# EAGLE design 00A-85 (EAGLE 6.3)
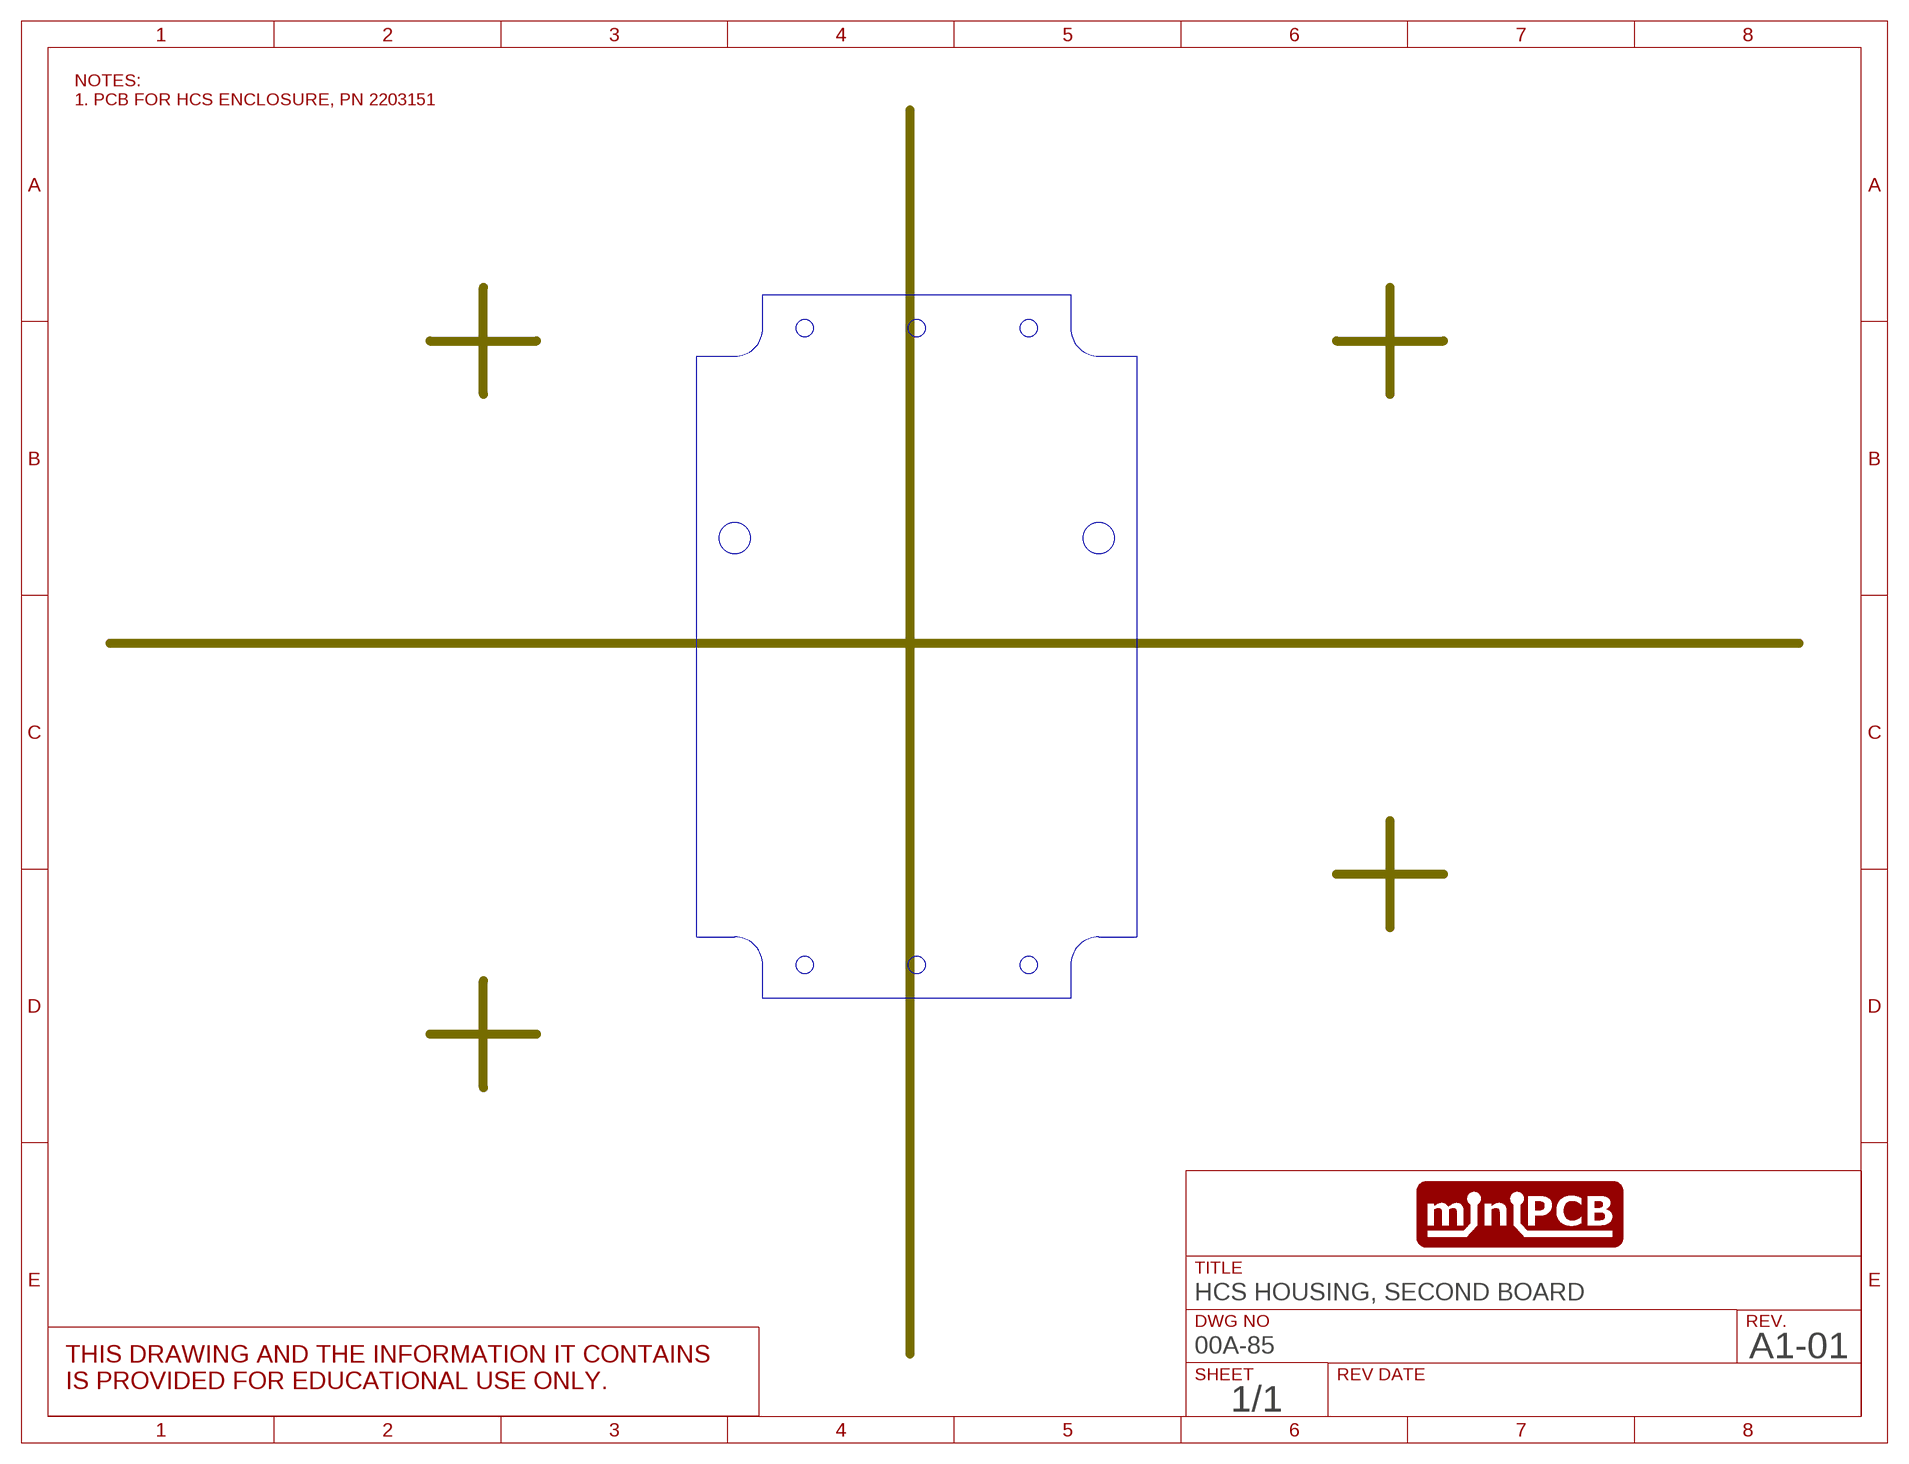
[diagram p0: schematic, sheet 1]
SHEET1 (SCHEMATIC): DWG_NO: 00A-85; REV: A1-01; TITLE: HCS HOUSING, SECOND BOARD

## Parts
U$1  HCS_HOUSING  [HCS_HOUSING_SECOND]

## Notes on the sheet
- NOTES:
  1. PCB FOR HCS ENCLOSURE, PN 2203151

## Library data of the parts
U$1 = miniPCB_BOARDS:HCS_HOUSING

## Board
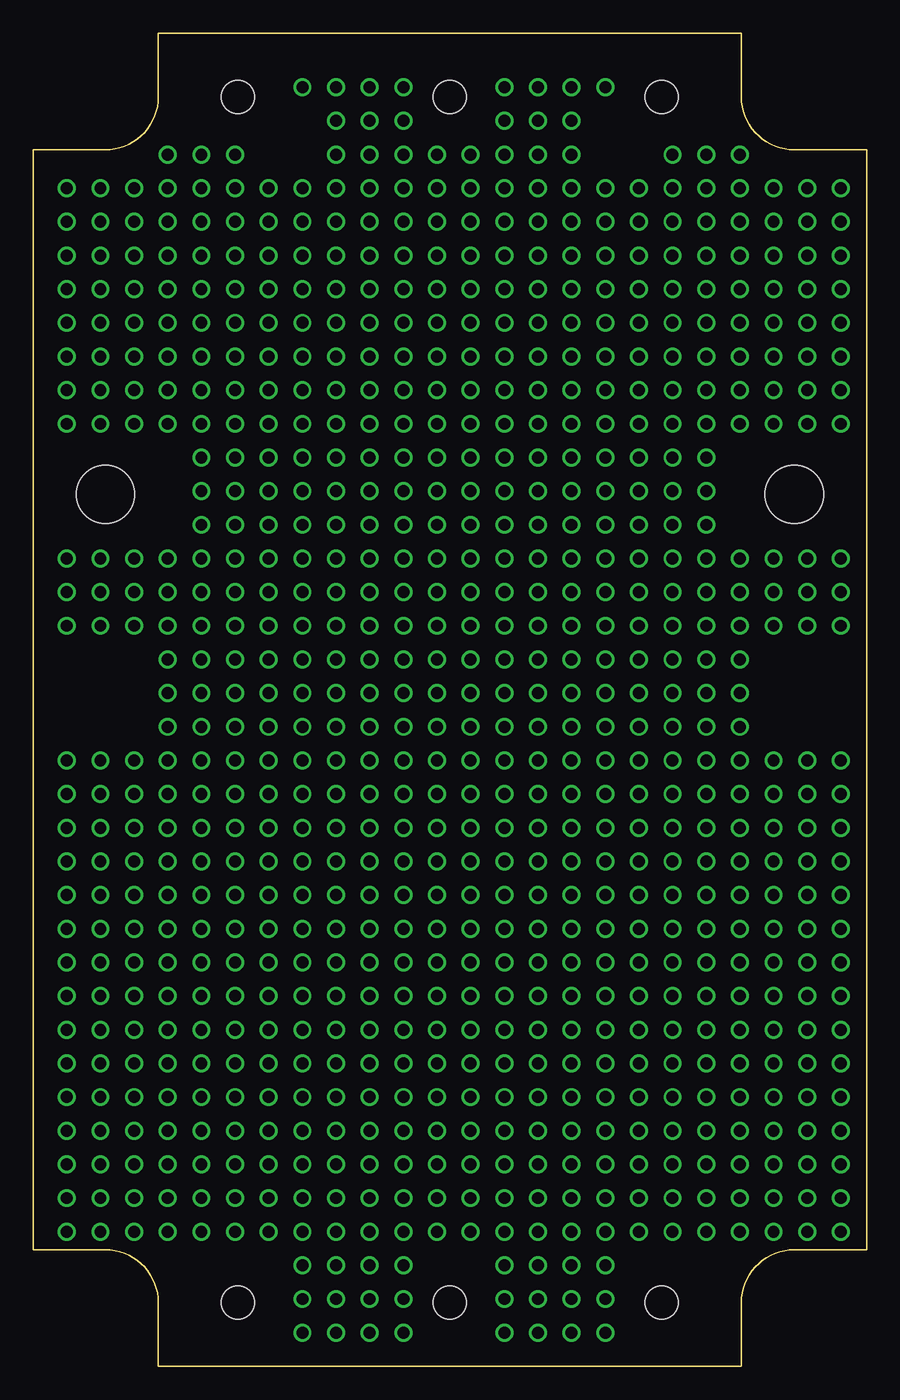
[diagram p1: board, top side]

Size 62.9 x 100.6 mm. Coordinates in mm from the lower left corner, seen from the top.
Copper layers (1*16): Top 0.035mm / dielectric 1.5mm / Bottom 0.035mm
Design rules "default": minimum track width 10mil, minimum drill 0.6mm, track to track 8mil, track to pad 8mil, pad to pad 8mil, via to via 8mil, smd to smd 8mil, copper to edge 40mil, drill to drill 8mil, minimum pad ring 10mil, minimum via ring 8mil, stop-mask expansion 4mil, vias tented up to drill 0mil, thermal gap 10mil

### Footprints (pad centres in the part's own frame; a part is rotated, then mirrored left to right if it is on the bottom)
HCS_HOUSING_SECOND = hole 2.5: 15.45,95.8; 31.45,95.8; 47.45,95.8; 15.45,4.8; 31.45,4.8; 47.45,4.8 | hole 4.4: 5.45,65.8; 57.45,65.8

### Placement (x,y rotation side)
U$1  0,0 0 top
U$2  [HCS_HOUSING_SECOND_LRYDIM]  0,0 0 top
U$3  [IMAGE_GERBER_FRAME]  -63.5,-50.8 0 top  (outside the outline)

### Tracks (layer width: path | path; a pad name or v marks a point on that pad's centre or on a via)
N$1  (via drill 0.9)
  other vias: 2.54,88.9
N$2  (via drill 0.9)
  other vias: 5.08,88.9
N$3  (via drill 0.9)
  other vias: 7.62,88.9
N$4  (via drill 0.9)
  other vias: 10.16,88.9
N$5  (via drill 0.9)
  other vias: 12.7,88.9
N$6  (via drill 0.9)
  other vias: 15.24,88.9
N$7  (via drill 0.9)
  other vias: 17.78,88.9
N$8  (via drill 0.9)
  other vias: 20.32,88.9
N$9  (via drill 0.9)
  other vias: 22.86,88.9
N$10  (via drill 0.9)
  other vias: 25.4,88.9
N$11  (via drill 0.9)
  other vias: 27.94,88.9
N$12  (via drill 0.9)
  other vias: 30.48,88.9
N$13  (via drill 0.9)
  other vias: 33.02,88.9
N$14  (via drill 0.9)
  other vias: 35.56,88.9
N$15  (via drill 0.9)
  other vias: 38.1,88.9
N$16  (via drill 0.9)
  other vias: 40.64,88.9
N$17  (via drill 0.9)
  other vias: 43.18,88.9
N$18  (via drill 0.9)
  other vias: 48.26,88.9
N$19  (via drill 0.9)
  other vias: 45.72,88.9
N$20  (via drill 0.9)
  other vias: 50.8,88.9
N$21  (via drill 0.9)
  other vias: 53.34,88.9
N$22  (via drill 0.9)
  other vias: 55.88,88.9
N$23  (via drill 0.9)
  other vias: 58.42,88.9
N$24  (via drill 0.9)
  other vias: 60.96,88.9
N$25  (via drill 0.9)
  other vias: 10.16,91.44
N$26  (via drill 0.9)
  other vias: 12.7,91.44
N$27  (via drill 0.9)
  other vias: 15.24,91.44
N$28  (via drill 0.9)
  other vias: 22.86,91.44
N$29  (via drill 0.9)
  other vias: 25.4,91.44
N$30  (via drill 0.9)
  other vias: 27.94,91.44
N$31  (via drill 0.9)
  other vias: 30.48,91.44
N$32  (via drill 0.9)
  other vias: 33.02,91.44
N$33  (via drill 0.9)
  other vias: 35.56,91.44
N$34  (via drill 0.9)
  other vias: 38.1,91.44
N$35  (via drill 0.9)
  other vias: 40.64,91.44
N$36  (via drill 0.9)
  other vias: 48.26,91.44
N$37  (via drill 0.9)
  other vias: 50.8,91.44
N$38  (via drill 0.9)
  other vias: 53.34,91.44
N$39  (via drill 0.9)
  other vias: 22.86,93.98
N$40  (via drill 0.9)
  other vias: 25.4,93.98
N$41  (via drill 0.9)
  other vias: 27.94,93.98
N$42  (via drill 0.9)
  other vias: 22.86,96.52
N$43  (via drill 0.9)
  other vias: 25.4,96.52
N$44  (via drill 0.9)
  other vias: 27.94,96.52
N$45  (via drill 0.9)
  other vias: 20.32,96.52
N$46  (via drill 0.9)
  other vias: 35.56,96.52
N$47  (via drill 0.9)
  other vias: 38.1,96.52
N$48  (via drill 0.9)
  other vias: 40.64,96.52
N$49  (via drill 0.9)
  other vias: 43.18,96.52
N$50  (via drill 0.9)
  other vias: 35.56,93.98
N$51  (via drill 0.9)
  other vias: 38.1,93.98
N$52  (via drill 0.9)
  other vias: 40.64,93.98
N$53  (via drill 0.9)
  other vias: 2.54,86.36
N$54  (via drill 0.9)
  other vias: 5.08,86.36
N$55  (via drill 0.9)
  other vias: 7.62,86.36
N$56  (via drill 0.9)
  other vias: 10.16,86.36
N$57  (via drill 0.9)
  other vias: 12.7,86.36
N$58  (via drill 0.9)
  other vias: 15.24,86.36
N$59  (via drill 0.9)
  other vias: 17.78,86.36
N$60  (via drill 0.9)
  other vias: 20.32,86.36
N$61  (via drill 0.9)
  other vias: 22.86,86.36
N$62  (via drill 0.9)
  other vias: 25.4,86.36
N$63  (via drill 0.9)
  other vias: 27.94,86.36
N$64  (via drill 0.9)
  other vias: 30.48,86.36
N$65  (via drill 0.9)
  other vias: 33.02,86.36
N$66  (via drill 0.9)
  other vias: 35.56,86.36
N$67  (via drill 0.9)
  other vias: 38.1,86.36
N$68  (via drill 0.9)
  other vias: 40.64,86.36
N$69  (via drill 0.9)
  other vias: 43.18,86.36
N$70  (via drill 0.9)
  other vias: 48.26,86.36
N$71  (via drill 0.9)
  other vias: 45.72,86.36
N$72  (via drill 0.9)
  other vias: 50.8,86.36
N$73  (via drill 0.9)
  other vias: 53.34,86.36
N$74  (via drill 0.9)
  other vias: 55.88,86.36
N$75  (via drill 0.9)
  other vias: 58.42,86.36
N$76  (via drill 0.9)
  other vias: 60.96,86.36
N$77  (via drill 0.9)
  other vias: 2.54,83.82
N$78  (via drill 0.9)
  other vias: 5.08,83.82
N$79  (via drill 0.9)
  other vias: 7.62,83.82
N$80  (via drill 0.9)
  other vias: 10.16,83.82
N$81  (via drill 0.9)
  other vias: 12.7,83.82
N$82  (via drill 0.9)
  other vias: 15.24,83.82
N$83  (via drill 0.9)
  other vias: 17.78,83.82
N$84  (via drill 0.9)
  other vias: 20.32,83.82
N$85  (via drill 0.9)
  other vias: 22.86,83.82
N$86  (via drill 0.9)
  other vias: 25.4,83.82
N$87  (via drill 0.9)
  other vias: 27.94,83.82
N$88  (via drill 0.9)
  other vias: 30.48,83.82
N$89  (via drill 0.9)
  other vias: 33.02,83.82
N$90  (via drill 0.9)
  other vias: 35.56,83.82
N$91  (via drill 0.9)
  other vias: 38.1,83.82
N$92  (via drill 0.9)
  other vias: 40.64,83.82
N$93  (via drill 0.9)
  other vias: 43.18,83.82
N$94  (via drill 0.9)
  other vias: 48.26,83.82
N$95  (via drill 0.9)
  other vias: 45.72,83.82
N$96  (via drill 0.9)
  other vias: 50.8,83.82
N$97  (via drill 0.9)
  other vias: 53.34,83.82
N$98  (via drill 0.9)
  other vias: 55.88,83.82
N$99  (via drill 0.9)
  other vias: 58.42,83.82
N$100  (via drill 0.9)
  other vias: 60.96,83.82
N$101  (via drill 0.9)
  other vias: 2.54,81.28
N$102  (via drill 0.9)
  other vias: 5.08,81.28
N$103  (via drill 0.9)
  other vias: 7.62,81.28
N$104  (via drill 0.9)
  other vias: 10.16,81.28
N$105  (via drill 0.9)
  other vias: 12.7,81.28
N$106  (via drill 0.9)
  other vias: 15.24,81.28
N$107  (via drill 0.9)
  other vias: 17.78,81.28
N$108  (via drill 0.9)
  other vias: 20.32,81.28
N$109  (via drill 0.9)
  other vias: 22.86,81.28
N$110  (via drill 0.9)
  other vias: 25.4,81.28
N$111  (via drill 0.9)
  other vias: 27.94,81.28
N$112  (via drill 0.9)
  other vias: 30.48,81.28
N$113  (via drill 0.9)
  other vias: 33.02,81.28
N$114  (via drill 0.9)
  other vias: 35.56,81.28
N$115  (via drill 0.9)
  other vias: 38.1,81.28
N$116  (via drill 0.9)
  other vias: 40.64,81.28
N$117  (via drill 0.9)
  other vias: 43.18,81.28
N$118  (via drill 0.9)
  other vias: 48.26,81.28
N$119  (via drill 0.9)
  other vias: 45.72,81.28
N$120  (via drill 0.9)
  other vias: 50.8,81.28
N$121  (via drill 0.9)
  other vias: 53.34,81.28
N$122  (via drill 0.9)
  other vias: 55.88,81.28
N$123  (via drill 0.9)
  other vias: 58.42,81.28
N$124  (via drill 0.9)
  other vias: 60.96,81.28
N$125  (via drill 0.9)
  other vias: 2.54,78.74
N$126  (via drill 0.9)
  other vias: 5.08,78.74
N$127  (via drill 0.9)
  other vias: 7.62,78.74
N$128  (via drill 0.9)
  other vias: 10.16,78.74
N$129  (via drill 0.9)
  other vias: 12.7,78.74
N$130  (via drill 0.9)
  other vias: 15.24,78.74
N$131  (via drill 0.9)
  other vias: 17.78,78.74
N$132  (via drill 0.9)
  other vias: 20.32,78.74
N$133  (via drill 0.9)
  other vias: 22.86,78.74
N$134  (via drill 0.9)
  other vias: 25.4,78.74
N$135  (via drill 0.9)
  other vias: 27.94,78.74
N$136  (via drill 0.9)
  other vias: 30.48,78.74
N$137  (via drill 0.9)
  other vias: 33.02,78.74
N$138  (via drill 0.9)
  other vias: 35.56,78.74
N$139  (via drill 0.9)
  other vias: 38.1,78.74
N$140  (via drill 0.9)
  other vias: 40.64,78.74
N$141  (via drill 0.9)
  other vias: 43.18,78.74
N$142  (via drill 0.9)
  other vias: 48.26,78.74
N$143  (via drill 0.9)
  other vias: 45.72,78.74
N$144  (via drill 0.9)
  other vias: 50.8,78.74
N$145  (via drill 0.9)
  other vias: 53.34,78.74
N$146  (via drill 0.9)
  other vias: 55.88,78.74
N$147  (via drill 0.9)
  other vias: 58.42,78.74
N$148  (via drill 0.9)
  other vias: 60.96,78.74
N$149  (via drill 0.9)
  other vias: 2.54,76.2
N$150  (via drill 0.9)
  other vias: 5.08,76.2
N$151  (via drill 0.9)
  other vias: 7.62,76.2
N$152  (via drill 0.9)
  other vias: 10.16,76.2
N$153  (via drill 0.9)
  other vias: 12.7,76.2
N$154  (via drill 0.9)
  other vias: 15.24,76.2
N$155  (via drill 0.9)
  other vias: 17.78,76.2
N$156  (via drill 0.9)
  other vias: 20.32,76.2
N$157  (via drill 0.9)
  other vias: 22.86,76.2
N$158  (via drill 0.9)
  other vias: 25.4,76.2
N$159  (via drill 0.9)
  other vias: 27.94,76.2
N$160  (via drill 0.9)
  other vias: 30.48,76.2
N$161  (via drill 0.9)
  other vias: 33.02,76.2
N$162  (via drill 0.9)
  other vias: 35.56,76.2
N$163  (via drill 0.9)
  other vias: 38.1,76.2
N$164  (via drill 0.9)
  other vias: 40.64,76.2
N$165  (via drill 0.9)
  other vias: 43.18,76.2
N$166  (via drill 0.9)
  other vias: 48.26,76.2
N$167  (via drill 0.9)
  other vias: 45.72,76.2
N$168  (via drill 0.9)
  other vias: 50.8,76.2
N$169  (via drill 0.9)
  other vias: 53.34,76.2
N$170  (via drill 0.9)
  other vias: 55.88,76.2
N$171  (via drill 0.9)
  other vias: 58.42,76.2
N$172  (via drill 0.9)
  other vias: 60.96,76.2
N$173  (via drill 0.9)
  other vias: 2.54,73.66
N$174  (via drill 0.9)
  other vias: 5.08,73.66
N$175  (via drill 0.9)
  other vias: 7.62,73.66
N$176  (via drill 0.9)
  other vias: 10.16,73.66
N$177  (via drill 0.9)
  other vias: 12.7,73.66
N$178  (via drill 0.9)
  other vias: 15.24,73.66
N$179  (via drill 0.9)
  other vias: 17.78,73.66
N$180  (via drill 0.9)
  other vias: 20.32,73.66
N$181  (via drill 0.9)
  other vias: 22.86,73.66
N$182  (via drill 0.9)
  other vias: 25.4,73.66
N$183  (via drill 0.9)
  other vias: 27.94,73.66
N$184  (via drill 0.9)
  other vias: 30.48,73.66
N$185  (via drill 0.9)
  other vias: 33.02,73.66
N$186  (via drill 0.9)
  other vias: 35.56,73.66
N$187  (via drill 0.9)
  other vias: 38.1,73.66
N$188  (via drill 0.9)
  other vias: 40.64,73.66
N$189  (via drill 0.9)
  other vias: 43.18,73.66
N$190  (via drill 0.9)
  other vias: 48.26,73.66
N$191  (via drill 0.9)
  other vias: 45.72,73.66
N$192  (via drill 0.9)
  other vias: 50.8,73.66
N$193  (via drill 0.9)
  other vias: 53.34,73.66
N$194  (via drill 0.9)
  other vias: 55.88,73.66
N$195  (via drill 0.9)
  other vias: 58.42,73.66
N$196  (via drill 0.9)
  other vias: 60.96,73.66
N$197  (via drill 0.9)
  other vias: 2.54,71.12
N$198  (via drill 0.9)
  other vias: 5.08,71.12
N$199  (via drill 0.9)
  other vias: 7.62,71.12
N$200  (via drill 0.9)
  other vias: 10.16,71.12
N$201  (via drill 0.9)
  other vias: 12.7,71.12
N$202  (via drill 0.9)
  other vias: 15.24,71.12
N$203  (via drill 0.9)
  other vias: 17.78,71.12
N$204  (via drill 0.9)
  other vias: 20.32,71.12
N$205  (via drill 0.9)
  other vias: 22.86,71.12
N$206  (via drill 0.9)
  other vias: 25.4,71.12
N$207  (via drill 0.9)
  other vias: 27.94,71.12
N$208  (via drill 0.9)
  other vias: 30.48,71.12
N$209  (via drill 0.9)
  other vias: 33.02,71.12
N$210  (via drill 0.9)
  other vias: 35.56,71.12
N$211  (via drill 0.9)
  other vias: 38.1,71.12
N$212  (via drill 0.9)
  other vias: 40.64,71.12
N$213  (via drill 0.9)
  other vias: 43.18,71.12
N$214  (via drill 0.9)
  other vias: 48.26,71.12
N$215  (via drill 0.9)
  other vias: 45.72,71.12
N$216  (via drill 0.9)
  other vias: 50.8,71.12
N$217  (via drill 0.9)
  other vias: 53.34,71.12
N$218  (via drill 0.9)
  other vias: 55.88,71.12
N$219  (via drill 0.9)
  other vias: 58.42,71.12
N$220  (via drill 0.9)
  other vias: 60.96,71.12
N$221  (via drill 0.9)
  other vias: 20.32,5.08
N$222  (via drill 0.9)
  other vias: 22.86,5.08
N$223  (via drill 0.9)
  other vias: 25.4,5.08
N$224  (via drill 0.9)
  other vias: 20.32,2.54
N$225  (via drill 0.9)
  other vias: 12.7,68.58
N$226  (via drill 0.9)
  other vias: 15.24,68.58
N$227  (via drill 0.9)
  other vias: 17.78,68.58
N$228  (via drill 0.9)
  other vias: 20.32,68.58
N$229  (via drill 0.9)
  other vias: 22.86,68.58
N$230  (via drill 0.9)
  other vias: 25.4,68.58
N$231  (via drill 0.9)
  other vias: 27.94,68.58
N$232  (via drill 0.9)
  other vias: 30.48,68.58
N$233  (via drill 0.9)
  other vias: 33.02,68.58
N$234  (via drill 0.9)
  other vias: 35.56,68.58
N$235  (via drill 0.9)
  other vias: 38.1,68.58
N$236  (via drill 0.9)
  other vias: 40.64,68.58
N$237  (via drill 0.9)
  other vias: 43.18,68.58
N$238  (via drill 0.9)
  other vias: 48.26,68.58
N$239  (via drill 0.9)
  other vias: 45.72,68.58
N$240  (via drill 0.9)
  other vias: 50.8,68.58
N$241  (via drill 0.9)
  other vias: 22.86,2.54
N$242  (via drill 0.9)
  other vias: 25.4,2.54
N$243  (via drill 0.9)
  other vias: 35.56,5.08
N$244  (via drill 0.9)
  other vias: 38.1,5.08
N$245  (via drill 0.9)
  other vias: 40.64,5.08
N$246  (via drill 0.9)
  other vias: 43.18,5.08
N$247  (via drill 0.9)
  other vias: 35.56,2.54
N$248  (via drill 0.9)
  other vias: 38.1,2.54
N$249  (via drill 0.9)
  other vias: 12.7,66.04
N$250  (via drill 0.9)
  other vias: 15.24,66.04
N$251  (via drill 0.9)
  other vias: 17.78,66.04
N$252  (via drill 0.9)
  other vias: 20.32,66.04
N$253  (via drill 0.9)
  other vias: 22.86,66.04
N$254  (via drill 0.9)
  other vias: 25.4,66.04
N$255  (via drill 0.9)
  other vias: 27.94,66.04
N$256  (via drill 0.9)
  other vias: 30.48,66.04
N$257  (via drill 0.9)
  other vias: 33.02,66.04
N$258  (via drill 0.9)
  other vias: 35.56,66.04
N$259  (via drill 0.9)
  other vias: 38.1,66.04
N$260  (via drill 0.9)
  other vias: 40.64,66.04
N$261  (via drill 0.9)
  other vias: 43.18,66.04
N$262  (via drill 0.9)
  other vias: 48.26,66.04
N$263  (via drill 0.9)
  other vias: 45.72,66.04
N$264  (via drill 0.9)
  other vias: 50.8,66.04
N$265  (via drill 0.9)
  other vias: 40.64,2.54
N$266  (via drill 0.9)
  other vias: 43.18,2.54
N$267  (via drill 0.9)
  other vias: 27.94,5.08
N$268  (via drill 0.9)
  other vias: 27.94,2.54
N$273  (via drill 0.9)
  other vias: 12.7,63.5
N$274  (via drill 0.9)
  other vias: 15.24,63.5
N$275  (via drill 0.9)
  other vias: 17.78,63.5
N$276  (via drill 0.9)
  other vias: 20.32,63.5
N$277  (via drill 0.9)
  other vias: 22.86,63.5
N$278  (via drill 0.9)
  other vias: 25.4,63.5
N$279  (via drill 0.9)
  other vias: 27.94,63.5
N$280  (via drill 0.9)
  other vias: 30.48,63.5
N$281  (via drill 0.9)
  other vias: 33.02,63.5
N$282  (via drill 0.9)
  other vias: 35.56,63.5
N$283  (via drill 0.9)
  other vias: 38.1,63.5
N$284  (via drill 0.9)
  other vias: 40.64,63.5
N$285  (via drill 0.9)
  other vias: 43.18,63.5
N$286  (via drill 0.9)
  other vias: 48.26,63.5
N$287  (via drill 0.9)
  other vias: 45.72,63.5
N$288  (via drill 0.9)
  other vias: 50.8,63.5
N$293  (via drill 0.9)
  other vias: 2.54,60.96
N$294  (via drill 0.9)
  other vias: 5.08,60.96
N$295  (via drill 0.9)
  other vias: 7.62,60.96
N$296  (via drill 0.9)
  other vias: 10.16,60.96
N$297  (via drill 0.9)
  other vias: 12.7,60.96
N$298  (via drill 0.9)
  other vias: 15.24,60.96
N$299  (via drill 0.9)
  other vias: 17.78,60.96
N$300  (via drill 0.9)
  other vias: 20.32,60.96
N$301  (via drill 0.9)
  other vias: 22.86,60.96
N$302  (via drill 0.9)
  other vias: 25.4,60.96
N$303  (via drill 0.9)
  other vias: 27.94,60.96
N$304  (via drill 0.9)
  other vias: 30.48,60.96
N$305  (via drill 0.9)
  other vias: 33.02,60.96
N$306  (via drill 0.9)
  other vias: 35.56,60.96
N$307  (via drill 0.9)
  other vias: 38.1,60.96
N$308  (via drill 0.9)
  other vias: 40.64,60.96
N$309  (via drill 0.9)
  other vias: 43.18,60.96
N$310  (via drill 0.9)
  other vias: 48.26,60.96
N$311  (via drill 0.9)
  other vias: 45.72,60.96
N$312  (via drill 0.9)
  other vias: 50.8,60.96
N$313  (via drill 0.9)
  other vias: 53.34,60.96
N$314  (via drill 0.9)
  other vias: 55.88,60.96
N$315  (via drill 0.9)
  other vias: 58.42,60.96
N$316  (via drill 0.9)
  other vias: 60.96,60.96
N$317  (via drill 0.9)
  other vias: 2.54,58.42
N$318  (via drill 0.9)
  other vias: 5.08,58.42
N$319  (via drill 0.9)
  other vias: 7.62,58.42
N$320  (via drill 0.9)
  other vias: 10.16,58.42
N$321  (via drill 0.9)
  other vias: 12.7,58.42
N$322  (via drill 0.9)
  other vias: 15.24,58.42
N$323  (via drill 0.9)
  other vias: 17.78,58.42
N$324  (via drill 0.9)
  other vias: 20.32,58.42
N$325  (via drill 0.9)
  other vias: 22.86,58.42
N$326  (via drill 0.9)
  other vias: 25.4,58.42
N$327  (via drill 0.9)
  other vias: 27.94,58.42
N$328  (via drill 0.9)
  other vias: 30.48,58.42
N$329  (via drill 0.9)
  other vias: 33.02,58.42
N$330  (via drill 0.9)
  other vias: 35.56,58.42
N$331  (via drill 0.9)
  other vias: 38.1,58.42
N$332  (via drill 0.9)
  other vias: 40.64,58.42
N$333  (via drill 0.9)
  other vias: 43.18,58.42
N$334  (via drill 0.9)
  other vias: 48.26,58.42
N$335  (via drill 0.9)
  other vias: 45.72,58.42
N$336  (via drill 0.9)
  other vias: 50.8,58.42
N$337  (via drill 0.9)
  other vias: 53.34,58.42
N$338  (via drill 0.9)
  other vias: 55.88,58.42
N$339  (via drill 0.9)
  other vias: 58.42,58.42
N$340  (via drill 0.9)
  other vias: 60.96,58.42
N$341  (via drill 0.9)
  other vias: 2.54,55.88
N$342  (via drill 0.9)
  other vias: 5.08,55.88
N$343  (via drill 0.9)
  other vias: 7.62,55.88
N$344  (via drill 0.9)
  other vias: 10.16,55.88
N$345  (via drill 0.9)
  other vias: 12.7,55.88
N$346  (via drill 0.9)
  other vias: 15.24,55.88
N$347  (via drill 0.9)
  other vias: 17.78,55.88
N$348  (via drill 0.9)
  other vias: 20.32,55.88
N$349  (via drill 0.9)
  other vias: 22.86,55.88
N$350  (via drill 0.9)
  other vias: 25.4,55.88
N$351  (via drill 0.9)
  other vias: 27.94,55.88
N$352  (via drill 0.9)
  other vias: 30.48,55.88
N$353  (via drill 0.9)
  other vias: 33.02,55.88
N$354  (via drill 0.9)
  other vias: 35.56,55.88
N$355  (via drill 0.9)
  other vias: 38.1,55.88
N$356  (via drill 0.9)
  other vias: 40.64,55.88
N$357  (via drill 0.9)
  other vias: 43.18,55.88
N$358  (via drill 0.9)
  other vias: 48.26,55.88
N$359  (via drill 0.9)
  other vias: 45.72,55.88
N$360  (via drill 0.9)
  other vias: 50.8,55.88
N$361  (via drill 0.9)
  other vias: 53.34,55.88
N$362  (via drill 0.9)
  other vias: 55.88,55.88
N$363  (via drill 0.9)
  other vias: 58.42,55.88
N$364  (via drill 0.9)
  other vias: 60.96,55.88
N$368  (via drill 0.9)
  other vias: 10.16,53.34
N$369  (via drill 0.9)
  other vias: 12.7,53.34
N$370  (via drill 0.9)
  other vias: 15.24,53.34
N$371  (via drill 0.9)
  other vias: 17.78,53.34
N$372  (via drill 0.9)
  other vias: 20.32,53.34
N$373  (via drill 0.9)
  other vias: 22.86,53.34
N$374  (via drill 0.9)
  other vias: 25.4,53.34
N$375  (via drill 0.9)
  other vias: 27.94,53.34
N$376  (via drill 0.9)
  other vias: 30.48,53.34
N$377  (via drill 0.9)
  other vias: 33.02,53.34
N$378  (via drill 0.9)
  other vias: 35.56,53.34
N$379  (via drill 0.9)
  other vias: 38.1,53.34
N$380  (via drill 0.9)
  other vias: 40.64,53.34
N$381  (via drill 0.9)
  other vias: 43.18,53.34
N$382  (via drill 0.9)
  other vias: 48.26,53.34
N$383  (via drill 0.9)
  other vias: 45.72,53.34
N$384  (via drill 0.9)
  other vias: 50.8,53.34
N$385  (via drill 0.9)
  other vias: 53.34,53.34
N$392  (via drill 0.9)
  other vias: 10.16,50.8
N$393  (via drill 0.9)
  other vias: 12.7,50.8
N$394  (via drill 0.9)
  other vias: 15.24,50.8
N$395  (via drill 0.9)
  other vias: 17.78,50.8
N$396  (via drill 0.9)
  other vias: 20.32,50.8
N$397  (via drill 0.9)
  other vias: 22.86,50.8
N$398  (via drill 0.9)
  other vias: 25.4,50.8
N$399  (via drill 0.9)
  other vias: 27.94,50.8
N$400  (via drill 0.9)
  other vias: 30.48,50.8
N$401  (via drill 0.9)
  other vias: 33.02,50.8
N$402  (via drill 0.9)
  other vias: 35.56,50.8
N$403  (via drill 0.9)
  other vias: 38.1,50.8
N$404  (via drill 0.9)
  other vias: 40.64,50.8
N$405  (via drill 0.9)
  other vias: 43.18,50.8
N$406  (via drill 0.9)
  other vias: 48.26,50.8
N$407  (via drill 0.9)
  other vias: 45.72,50.8
N$408  (via drill 0.9)
  other vias: 50.8,50.8
N$409  (via drill 0.9)
  other vias: 53.34,50.8
N$416  (via drill 0.9)
  other vias: 10.16,48.26
N$417  (via drill 0.9)
  other vias: 12.7,48.26
N$418  (via drill 0.9)
  other vias: 15.24,48.26
N$419  (via drill 0.9)
  other vias: 17.78,48.26
N$420  (via drill 0.9)
  other vias: 20.32,48.26
N$421  (via drill 0.9)
  other vias: 22.86,48.26
N$422  (via drill 0.9)
  other vias: 25.4,48.26
N$423  (via drill 0.9)
  other vias: 27.94,48.26
N$424  (via drill 0.9)
  other vias: 30.48,48.26
N$425  (via drill 0.9)
  other vias: 33.02,48.26
N$426  (via drill 0.9)
  other vias: 35.56,48.26
N$427  (via drill 0.9)
  other vias: 38.1,48.26
N$428  (via drill 0.9)
  other vias: 40.64,48.26
N$429  (via drill 0.9)
  other vias: 43.18,48.26
N$430  (via drill 0.9)
  other vias: 48.26,48.26
N$431  (via drill 0.9)
  other vias: 45.72,48.26
N$432  (via drill 0.9)
  other vias: 50.8,48.26
N$433  (via drill 0.9)
  other vias: 53.34,48.26
N$437  (via drill 0.9)
  other vias: 2.54,45.72
N$438  (via drill 0.9)
  other vias: 5.08,45.72
N$439  (via drill 0.9)
  other vias: 7.62,45.72
N$440  (via drill 0.9)
  other vias: 10.16,45.72
N$441  (via drill 0.9)
  other vias: 12.7,45.72
N$442  (via drill 0.9)
  other vias: 15.24,45.72
N$443  (via drill 0.9)
  other vias: 17.78,45.72
N$444  (via drill 0.9)
  other vias: 20.32,45.72
N$445  (via drill 0.9)
  other vias: 22.86,45.72
N$446  (via drill 0.9)
  other vias: 25.4,45.72
N$447  (via drill 0.9)
  other vias: 27.94,45.72
N$448  (via drill 0.9)
  other vias: 30.48,45.72
N$449  (via drill 0.9)
  other vias: 33.02,45.72
N$450  (via drill 0.9)
  other vias: 35.56,45.72
N$451  (via drill 0.9)
  other vias: 38.1,45.72
N$452  (via drill 0.9)
  other vias: 40.64,45.72
N$453  (via drill 0.9)
  other vias: 43.18,45.72
N$454  (via drill 0.9)
  other vias: 48.26,45.72
N$455  (via drill 0.9)
  other vias: 45.72,45.72
N$456  (via drill 0.9)
  other vias: 50.8,45.72
N$457  (via drill 0.9)
  other vias: 53.34,45.72
N$458  (via drill 0.9)
  other vias: 55.88,45.72
N$459  (via drill 0.9)
  other vias: 58.42,45.72
N$460  (via drill 0.9)
  other vias: 60.96,45.72
N$461  (via drill 0.9)
  other vias: 2.54,43.18
N$462  (via drill 0.9)
  other vias: 5.08,43.18
N$463  (via drill 0.9)
  other vias: 7.62,43.18
N$464  (via drill 0.9)
  other vias: 10.16,43.18
N$465  (via drill 0.9)
  other vias: 12.7,43.18
N$466  (via drill 0.9)
  other vias: 15.24,43.18
N$467  (via drill 0.9)
  other vias: 17.78,43.18
N$468  (via drill 0.9)
  other vias: 20.32,43.18
N$469  (via drill 0.9)
  other vias: 22.86,43.18
N$470  (via drill 0.9)
  other vias: 25.4,43.18
N$471  (via drill 0.9)
  other vias: 27.94,43.18
N$472  (via drill 0.9)
  other vias: 30.48,43.18
N$473  (via drill 0.9)
  other vias: 33.02,43.18
N$474  (via drill 0.9)
  other vias: 35.56,43.18
N$475  (via drill 0.9)
  other vias: 38.1,43.18
N$476  (via drill 0.9)
  other vias: 40.64,43.18
N$477  (via drill 0.9)
  other vias: 43.18,43.18
N$478  (via drill 0.9)
  other vias: 48.26,43.18
N$479  (via drill 0.9)
  other vias: 45.72,43.18
N$480  (via drill 0.9)
  other vias: 50.8,43.18
N$481  (via drill 0.9)
  other vias: 53.34,43.18
N$482  (via drill 0.9)
  other vias: 55.88,43.18
N$483  (via drill 0.9)
  other vias: 58.42,43.18
N$484  (via drill 0.9)
  other vias: 60.96,43.18
N$485  (via drill 0.9)
  other vias: 2.54,40.64
N$486  (via drill 0.9)
  other vias: 5.08,40.64
N$487  (via drill 0.9)
  other vias: 7.62,40.64
N$488  (via drill 0.9)
  other vias: 10.16,40.64
N$489  (via drill 0.9)
  other vias: 12.7,40.64
N$490  (via drill 0.9)
  other vias: 15.24,40.64
N$491  (via drill 0.9)
  other vias: 17.78,40.64
N$492  (via drill 0.9)
  other vias: 20.32,40.64
N$493  (via drill 0.9)
  other vias: 22.86,40.64
N$494  (via drill 0.9)
  other vias: 25.4,40.64
N$495  (via drill 0.9)
  other vias: 27.94,40.64
N$496  (via drill 0.9)
  other vias: 30.48,40.64
N$497  (via drill 0.9)
  other vias: 33.02,40.64
N$498  (via drill 0.9)
  other vias: 35.56,40.64
N$499  (via drill 0.9)
  other vias: 38.1,40.64
N$500  (via drill 0.9)
  other vias: 40.64,40.64
N$501  (via drill 0.9)
  other vias: 43.18,40.64
N$502  (via drill 0.9)
  other vias: 48.26,40.64
N$503  (via drill 0.9)
  other vias: 45.72,40.64
N$504  (via drill 0.9)
  other vias: 50.8,40.64
N$505  (via drill 0.9)
  other vias: 53.34,40.64
N$506  (via drill 0.9)
  other vias: 55.88,40.64
N$507  (via drill 0.9)
  other vias: 58.42,40.64
N$508  (via drill 0.9)
  other vias: 60.96,40.64
N$509  (via drill 0.9)
  other vias: 2.54,38.1
N$510  (via drill 0.9)
  other vias: 5.08,38.1
N$511  (via drill 0.9)
  other vias: 7.62,38.1
N$512  (via drill 0.9)
  other vias: 10.16,38.1
N$513  (via drill 0.9)
  other vias: 12.7,38.1
N$514  (via drill 0.9)
  other vias: 15.24,38.1
N$515  (via drill 0.9)
  other vias: 17.78,38.1
N$516  (via drill 0.9)
  other vias: 20.32,38.1
N$517  (via drill 0.9)
  other vias: 22.86,38.1
N$518  (via drill 0.9)
  other vias: 25.4,38.1
N$519  (via drill 0.9)
  other vias: 27.94,38.1
N$520  (via drill 0.9)
  other vias: 30.48,38.1
N$521  (via drill 0.9)
  other vias: 33.02,38.1
N$522  (via drill 0.9)
  other vias: 35.56,38.1
N$523  (via drill 0.9)
  other vias: 38.1,38.1
N$524  (via drill 0.9)
  other vias: 40.64,38.1
N$525  (via drill 0.9)
  other vias: 43.18,38.1
N$526  (via drill 0.9)
  other vias: 48.26,38.1
N$527  (via drill 0.9)
  other vias: 45.72,38.1
N$528  (via drill 0.9)
  other vias: 50.8,38.1
N$529  (via drill 0.9)
  other vias: 53.34,38.1
N$530  (via drill 0.9)
  other vias: 55.88,38.1
N$531  (via drill 0.9)
  other vias: 58.42,38.1
N$532  (via drill 0.9)
  other vias: 60.96,38.1
N$533  (via drill 0.9)
  other vias: 2.54,35.56
N$534  (via drill 0.9)
  other vias: 5.08,35.56
N$535  (via drill 0.9)
  other vias: 7.62,35.56
N$536  (via drill 0.9)
  other vias: 10.16,35.56
N$537  (via drill 0.9)
  other vias: 12.7,35.56
N$538  (via drill 0.9)
  other vias: 15.24,35.56
N$539  (via drill 0.9)
  other vias: 17.78,35.56
N$540  (via drill 0.9)
  other vias: 20.32,35.56
N$541  (via drill 0.9)
  other vias: 22.86,35.56
N$542  (via drill 0.9)
  other vias: 25.4,35.56
N$543  (via drill 0.9)
  other vias: 27.94,35.56
N$544  (via drill 0.9)
  other vias: 30.48,35.56
N$545  (via drill 0.9)
  other vias: 33.02,35.56
N$546  (via drill 0.9)
  other vias: 35.56,35.56
N$547  (via drill 0.9)
  other vias: 38.1,35.56
N$548  (via drill 0.9)
  other vias: 40.64,35.56
N$549  (via drill 0.9)
  other vias: 43.18,35.56
N$550  (via drill 0.9)
  other vias: 48.26,35.56
N$551  (via drill 0.9)
  other vias: 45.72,35.56
N$552  (via drill 0.9)
  other vias: 50.8,35.56
N$553  (via drill 0.9)
  other vias: 53.34,35.56
N$554  (via drill 0.9)
  other vias: 55.88,35.56
N$555  (via drill 0.9)
  other vias: 58.42,35.56
N$556  (via drill 0.9)
  other vias: 60.96,35.56
N$557  (via drill 0.9)
  other vias: 2.54,33.02
N$558  (via drill 0.9)
  other vias: 5.08,33.02
N$559  (via drill 0.9)
  other vias: 7.62,33.02
N$560  (via drill 0.9)
  other vias: 10.16,33.02
N$561  (via drill 0.9)
  other vias: 12.7,33.02
N$562  (via drill 0.9)
  other vias: 15.24,33.02
N$563  (via drill 0.9)
  other vias: 17.78,33.02
N$564  (via drill 0.9)
  other vias: 20.32,33.02
N$565  (via drill 0.9)
  other vias: 22.86,33.02
N$566  (via drill 0.9)
  other vias: 25.4,33.02
N$567  (via drill 0.9)
  other vias: 27.94,33.02
N$568  (via drill 0.9)
  other vias: 30.48,33.02
N$569  (via drill 0.9)
  other vias: 33.02,33.02
N$570  (via drill 0.9)
  other vias: 35.56,33.02
N$571  (via drill 0.9)
  other vias: 38.1,33.02
N$572  (via drill 0.9)
  other vias: 40.64,33.02
N$573  (via drill 0.9)
  other vias: 43.18,33.02
N$574  (via drill 0.9)
  other vias: 48.26,33.02
N$575  (via drill 0.9)
  other vias: 45.72,33.02
N$576  (via drill 0.9)
  other vias: 50.8,33.02
N$577  (via drill 0.9)
  other vias: 53.34,33.02
N$578  (via drill 0.9)
  other vias: 55.88,33.02
N$579  (via drill 0.9)
  other vias: 58.42,33.02
N$580  (via drill 0.9)
  other vias: 60.96,33.02
N$581  (via drill 0.9)
  other vias: 2.54,30.48
N$582  (via drill 0.9)
  other vias: 5.08,30.48
N$583  (via drill 0.9)
  other vias: 7.62,30.48
N$584  (via drill 0.9)
  other vias: 10.16,30.48
N$585  (via drill 0.9)
  other vias: 12.7,30.48
N$586  (via drill 0.9)
  other vias: 15.24,30.48
N$587  (via drill 0.9)
  other vias: 17.78,30.48
N$588  (via drill 0.9)
  other vias: 20.32,30.48
N$589  (via drill 0.9)
  other vias: 22.86,30.48
N$590  (via drill 0.9)
  other vias: 25.4,30.48
N$591  (via drill 0.9)
  other vias: 27.94,30.48
N$592  (via drill 0.9)
  other vias: 30.48,30.48
N$593  (via drill 0.9)
  other vias: 33.02,30.48
N$594  (via drill 0.9)
  other vias: 35.56,30.48
N$595  (via drill 0.9)
  other vias: 38.1,30.48
N$596  (via drill 0.9)
  other vias: 40.64,30.48
N$597  (via drill 0.9)
  other vias: 43.18,30.48
N$598  (via drill 0.9)
  other vias: 48.26,30.48
N$599  (via drill 0.9)
  other vias: 45.72,30.48
N$600  (via drill 0.9)
  other vias: 50.8,30.48
N$601  (via drill 0.9)
  other vias: 53.34,30.48
N$602  (via drill 0.9)
  other vias: 55.88,30.48
N$603  (via drill 0.9)
  other vias: 58.42,30.48
N$604  (via drill 0.9)
  other vias: 60.96,30.48
N$605  (via drill 0.9)
  other vias: 2.54,27.94
N$606  (via drill 0.9)
  other vias: 5.08,27.94
N$607  (via drill 0.9)
  other vias: 7.62,27.94
N$608  (via drill 0.9)
  other vias: 10.16,27.94
N$609  (via drill 0.9)
  other vias: 12.7,27.94
N$610  (via drill 0.9)
  other vias: 15.24,27.94
N$611  (via drill 0.9)
  other vias: 17.78,27.94
N$612  (via drill 0.9)
  other vias: 20.32,27.94
N$613  (via drill 0.9)
  other vias: 22.86,27.94
N$614  (via drill 0.9)
  other vias: 25.4,27.94
N$615  (via drill 0.9)
  other vias: 27.94,27.94
N$616  (via drill 0.9)
  other vias: 30.48,27.94
N$617  (via drill 0.9)
  other vias: 33.02,27.94
N$618  (via drill 0.9)
  other vias: 35.56,27.94
N$619  (via drill 0.9)
  other vias: 38.1,27.94
N$620  (via drill 0.9)
  other vias: 40.64,27.94
N$621  (via drill 0.9)
  other vias: 43.18,27.94
N$622  (via drill 0.9)
  other vias: 48.26,27.94
N$623  (via drill 0.9)
  other vias: 45.72,27.94
N$624  (via drill 0.9)
  other vias: 50.8,27.94
N$625  (via drill 0.9)
  other vias: 53.34,27.94
N$626  (via drill 0.9)
  other vias: 55.88,27.94
N$627  (via drill 0.9)
  other vias: 58.42,27.94
N$628  (via drill 0.9)
  other vias: 60.96,27.94
N$629  (via drill 0.9)
  other vias: 2.54,25.4
N$630  (via drill 0.9)
  other vias: 5.08,25.4
N$631  (via drill 0.9)
  other vias: 7.62,25.4
N$632  (via drill 0.9)
  other vias: 10.16,25.4
N$633  (via drill 0.9)
  other vias: 12.7,25.4
N$634  (via drill 0.9)
  other vias: 15.24,25.4
N$635  (via drill 0.9)
  other vias: 17.78,25.4
N$636  (via drill 0.9)
  other vias: 20.32,25.4
N$637  (via drill 0.9)
  other vias: 22.86,25.4
N$638  (via drill 0.9)
  other vias: 25.4,25.4
N$639  (via drill 0.9)
  other vias: 27.94,25.4
N$640  (via drill 0.9)
  other vias: 30.48,25.4
N$641  (via drill 0.9)
  other vias: 33.02,25.4
N$642  (via drill 0.9)
  other vias: 35.56,25.4
N$643  (via drill 0.9)
  other vias: 38.1,25.4
N$644  (via drill 0.9)
  other vias: 40.64,25.4
N$645  (via drill 0.9)
  other vias: 43.18,25.4
N$646  (via drill 0.9)
  other vias: 48.26,25.4
N$647  (via drill 0.9)
  other vias: 45.72,25.4
N$648  (via drill 0.9)
  other vias: 50.8,25.4
N$649  (via drill 0.9)
  other vias: 53.34,25.4
N$650  (via drill 0.9)
  other vias: 55.88,25.4
N$651  (via drill 0.9)
  other vias: 58.42,25.4
N$652  (via drill 0.9)
  other vias: 60.96,25.4
N$653  (via drill 0.9)
  other vias: 2.54,22.86
N$654  (via drill 0.9)
  other vias: 5.08,22.86
N$655  (via drill 0.9)
  other vias: 7.62,22.86
N$656  (via drill 0.9)
  other vias: 10.16,22.86
N$657  (via drill 0.9)
  other vias: 12.7,22.86
N$658  (via drill 0.9)
  other vias: 15.24,22.86
N$659  (via drill 0.9)
  other vias: 17.78,22.86
N$660  (via drill 0.9)
  other vias: 20.32,22.86
N$661  (via drill 0.9)
  other vias: 22.86,22.86
N$662  (via drill 0.9)
  other vias: 25.4,22.86
N$663  (via drill 0.9)
  other vias: 27.94,22.86
N$664  (via drill 0.9)
  other vias: 30.48,22.86
N$665  (via drill 0.9)
  other vias: 33.02,22.86
N$666  (via drill 0.9)
  other vias: 35.56,22.86
N$667  (via drill 0.9)
  other vias: 38.1,22.86
N$668  (via drill 0.9)
  other vias: 40.64,22.86
N$669  (via drill 0.9)
  other vias: 43.18,22.86
N$670  (via drill 0.9)
  other vias: 48.26,22.86
N$671  (via drill 0.9)
  other vias: 45.72,22.86
N$672  (via drill 0.9)
  other vias: 50.8,22.86
N$673  (via drill 0.9)
  other vias: 53.34,22.86
N$674  (via drill 0.9)
  other vias: 55.88,22.86
N$675  (via drill 0.9)
  other vias: 58.42,22.86
N$676  (via drill 0.9)
  other vias: 60.96,22.86
N$677  (via drill 0.9)
  other vias: 2.54,20.32
N$678  (via drill 0.9)
  other vias: 5.08,20.32
N$679  (via drill 0.9)
  other vias: 7.62,20.32
N$680  (via drill 0.9)
  other vias: 10.16,20.32
N$681  (via drill 0.9)
  other vias: 12.7,20.32
N$682  (via drill 0.9)
  other vias: 15.24,20.32
N$683  (via drill 0.9)
  other vias: 17.78,20.32
N$684  (via drill 0.9)
  other vias: 20.32,20.32
N$685  (via drill 0.9)
  other vias: 22.86,20.32
N$686  (via drill 0.9)
  other vias: 25.4,20.32
N$687  (via drill 0.9)
  other vias: 27.94,20.32
N$688  (via drill 0.9)
  other vias: 30.48,20.32
N$689  (via drill 0.9)
  other vias: 33.02,20.32
N$690  (via drill 0.9)
  other vias: 35.56,20.32
N$691  (via drill 0.9)
  other vias: 38.1,20.32
N$692  (via drill 0.9)
  other vias: 40.64,20.32
N$693  (via drill 0.9)
  other vias: 43.18,20.32
N$694  (via drill 0.9)
  other vias: 48.26,20.32
N$695  (via drill 0.9)
  other vias: 45.72,20.32
N$696  (via drill 0.9)
  other vias: 50.8,20.32
N$697  (via drill 0.9)
  other vias: 53.34,20.32
N$698  (via drill 0.9)
  other vias: 55.88,20.32
N$699  (via drill 0.9)
  other vias: 58.42,20.32
N$700  (via drill 0.9)
  other vias: 60.96,20.32
N$701  (via drill 0.9)
  other vias: 2.54,17.78
N$702  (via drill 0.9)
  other vias: 5.08,17.78
N$703  (via drill 0.9)
  other vias: 7.62,17.78
N$704  (via drill 0.9)
  other vias: 10.16,17.78
N$705  (via drill 0.9)
  other vias: 12.7,17.78
N$706  (via drill 0.9)
  other vias: 15.24,17.78
N$707  (via drill 0.9)
  other vias: 17.78,17.78
N$708  (via drill 0.9)
  other vias: 20.32,17.78
N$709  (via drill 0.9)
  other vias: 22.86,17.78
N$710  (via drill 0.9)
  other vias: 25.4,17.78
N$711  (via drill 0.9)
  other vias: 27.94,17.78
N$712  (via drill 0.9)
  other vias: 30.48,17.78
N$713  (via drill 0.9)
  other vias: 33.02,17.78
N$714  (via drill 0.9)
  other vias: 35.56,17.78
N$715  (via drill 0.9)
  other vias: 38.1,17.78
N$716  (via drill 0.9)
  other vias: 40.64,17.78
N$717  (via drill 0.9)
  other vias: 43.18,17.78
N$718  (via drill 0.9)
  other vias: 48.26,17.78
N$719  (via drill 0.9)
  other vias: 45.72,17.78
N$720  (via drill 0.9)
  other vias: 50.8,17.78
N$721  (via drill 0.9)
  other vias: 53.34,17.78
N$722  (via drill 0.9)
  other vias: 55.88,17.78
N$723  (via drill 0.9)
  other vias: 58.42,17.78
N$724  (via drill 0.9)
  other vias: 60.96,17.78
N$725  (via drill 0.9)
  other vias: 2.54,15.24
N$726  (via drill 0.9)
  other vias: 5.08,15.24
N$727  (via drill 0.9)
  other vias: 7.62,15.24
N$728  (via drill 0.9)
  other vias: 10.16,15.24
N$729  (via drill 0.9)
  other vias: 12.7,15.24
N$730  (via drill 0.9)
  other vias: 15.24,15.24
N$731  (via drill 0.9)
  other vias: 17.78,15.24
N$732  (via drill 0.9)
  other vias: 20.32,15.24
N$733  (via drill 0.9)
  other vias: 22.86,15.24
N$734  (via drill 0.9)
  other vias: 25.4,15.24
N$735  (via drill 0.9)
  other vias: 27.94,15.24
N$736  (via drill 0.9)
  other vias: 30.48,15.24
N$737  (via drill 0.9)
  other vias: 33.02,15.24
N$738  (via drill 0.9)
  other vias: 35.56,15.24
N$739  (via drill 0.9)
  other vias: 38.1,15.24
N$740  (via drill 0.9)
  other vias: 40.64,15.24
N$741  (via drill 0.9)
  other vias: 43.18,15.24
N$742  (via drill 0.9)
  other vias: 48.26,15.24
N$743  (via drill 0.9)
  other vias: 45.72,15.24
N$744  (via drill 0.9)
  other vias: 50.8,15.24
N$745  (via drill 0.9)
  other vias: 53.34,15.24
N$746  (via drill 0.9)
  other vias: 55.88,15.24
N$747  (via drill 0.9)
  other vias: 58.42,15.24
N$748  (via drill 0.9)
  other vias: 60.96,15.24
N$749  (via drill 0.9)
  other vias: 2.54,12.7
N$750  (via drill 0.9)
  other vias: 5.08,12.7
N$751  (via drill 0.9)
  other vias: 7.62,12.7
N$752  (via drill 0.9)
  other vias: 10.16,12.7
N$753  (via drill 0.9)
  other vias: 12.7,12.7
N$754  (via drill 0.9)
  other vias: 15.24,12.7
N$755  (via drill 0.9)
  other vias: 17.78,12.7
N$756  (via drill 0.9)
  other vias: 20.32,12.7
N$757  (via drill 0.9)
  other vias: 22.86,12.7
N$758  (via drill 0.9)
  other vias: 25.4,12.7
N$759  (via drill 0.9)
  other vias: 27.94,12.7
N$760  (via drill 0.9)
  other vias: 30.48,12.7
N$761  (via drill 0.9)
  other vias: 33.02,12.7
N$762  (via drill 0.9)
  other vias: 35.56,12.7
N$763  (via drill 0.9)
  other vias: 38.1,12.7
N$764  (via drill 0.9)
  other vias: 40.64,12.7
N$765  (via drill 0.9)
  other vias: 43.18,12.7
N$766  (via drill 0.9)
  other vias: 48.26,12.7
N$767  (via drill 0.9)
  other vias: 45.72,12.7
N$768  (via drill 0.9)
  other vias: 50.8,12.7
N$769  (via drill 0.9)
  other vias: 53.34,12.7
N$770  (via drill 0.9)
  other vias: 55.88,12.7
N$771  (via drill 0.9)
  other vias: 58.42,12.7
N$772  (via drill 0.9)
  other vias: 60.96,12.7
N$773  (via drill 0.9)
  other vias: 2.54,10.16
N$774  (via drill 0.9)
  other vias: 5.08,10.16
N$775  (via drill 0.9)
  other vias: 7.62,10.16
N$776  (via drill 0.9)
  other vias: 10.16,10.16
N$777  (via drill 0.9)
  other vias: 12.7,10.16
N$778  (via drill 0.9)
  other vias: 15.24,10.16
N$779  (via drill 0.9)
  other vias: 17.78,10.16
N$780  (via drill 0.9)
  other vias: 20.32,10.16
N$781  (via drill 0.9)
  other vias: 22.86,10.16
N$782  (via drill 0.9)
  other vias: 25.4,10.16
N$783  (via drill 0.9)
  other vias: 27.94,10.16
N$784  (via drill 0.9)
  other vias: 30.48,10.16
N$785  (via drill 0.9)
  other vias: 33.02,10.16
N$786  (via drill 0.9)
  other vias: 35.56,10.16
N$787  (via drill 0.9)
  other vias: 38.1,10.16
N$788  (via drill 0.9)
  other vias: 40.64,10.16
N$789  (via drill 0.9)
  other vias: 43.18,10.16
N$790  (via drill 0.9)
  other vias: 48.26,10.16
N$791  (via drill 0.9)
  other vias: 45.72,10.16
N$792  (via drill 0.9)
  other vias: 50.8,10.16
N$793  (via drill 0.9)
  other vias: 53.34,10.16
N$794  (via drill 0.9)
  other vias: 55.88,10.16
N$795  (via drill 0.9)
  other vias: 58.42,10.16
N$796  (via drill 0.9)
  other vias: 60.96,10.16
N$804  (via drill 0.9)
  other vias: 20.32,7.62
N$805  (via drill 0.9)
  other vias: 22.86,7.62
N$806  (via drill 0.9)
  other vias: 25.4,7.62
N$807  (via drill 0.9)
  other vias: 27.94,7.62
N$810  (via drill 0.9)
  other vias: 35.56,7.62
N$811  (via drill 0.9)
  other vias: 38.1,7.62
N$812  (via drill 0.9)
  other vias: 40.64,7.62
N$813  (via drill 0.9)
  other vias: 43.18,7.62